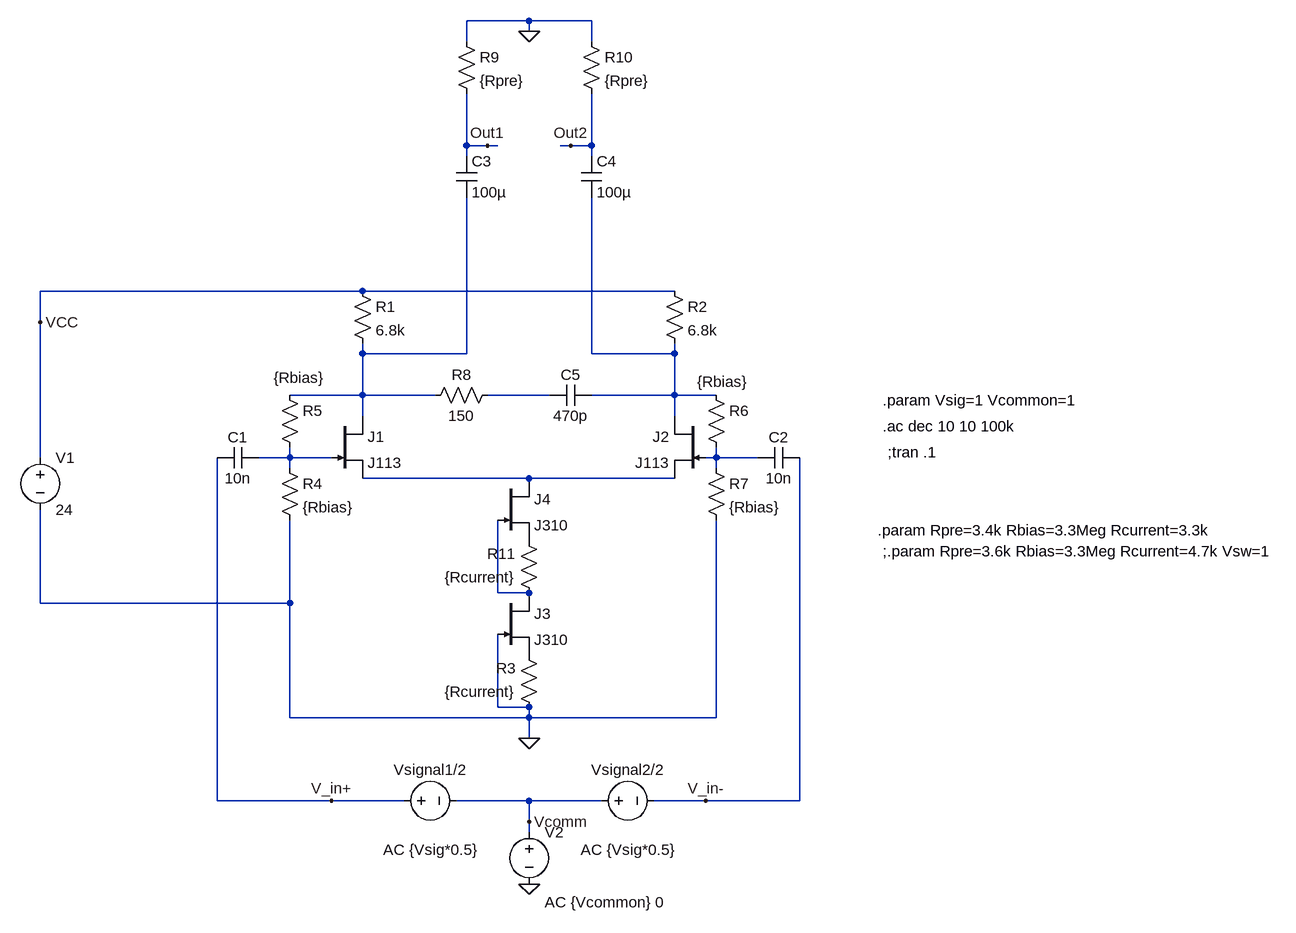
[diagram p0: schematic Preamp_doublecurrent.asc]
Preamp_doublecurrent.asc, the LTspice schematic file:
Version 4
SHEET 1 1784 1228
WIRE 576 -240 480 -240
WIRE 672 -240 576 -240
WIRE 576 -224 576 -240
WIRE 480 -208 480 -240
WIRE 672 -208 672 -240
WIRE 480 -48 480 -128
WIRE 512 -48 480 -48
WIRE 528 -48 512 -48
WIRE 640 -48 624 -48
WIRE 672 -48 672 -128
WIRE 672 -48 640 -48
WIRE 480 -32 480 -48
WIRE 672 -32 672 -48
WIRE 320 176 -176 176
WIRE 800 176 320 176
WIRE -176 224 -176 176
WIRE 320 272 320 256
WIRE 480 272 480 32
WIRE 480 272 320 272
WIRE 672 272 672 32
WIRE 800 272 800 256
WIRE 800 272 672 272
WIRE 320 336 320 272
WIRE 320 336 208 336
WIRE 432 336 320 336
WIRE 608 336 512 336
WIRE 800 336 800 272
WIRE 800 336 672 336
WIRE 864 336 800 336
WIRE 320 368 320 336
WIRE 800 368 800 336
WIRE -176 432 -176 224
WIRE 208 432 208 416
WIRE 208 432 160 432
WIRE 272 432 208 432
WIRE 864 432 864 416
WIRE 864 432 848 432
WIRE 928 432 864 432
WIRE 208 448 208 432
WIRE 864 448 864 432
WIRE 576 464 320 464
WIRE 800 464 576 464
WIRE 528 640 528 528
WIRE 576 640 528 640
WIRE -176 656 -176 512
WIRE 208 656 208 528
WIRE 208 656 -176 656
WIRE 528 816 528 704
WIRE 576 816 528 816
WIRE 208 832 208 656
WIRE 576 832 576 816
WIRE 576 832 208 832
WIRE 864 832 864 528
WIRE 864 832 576 832
WIRE 576 864 576 832
WIRE 96 960 96 432
WIRE 272 960 96 960
WIRE 384 960 272 960
WIRE 576 960 464 960
WIRE 688 960 576 960
WIRE 848 960 768 960
WIRE 992 960 992 432
WIRE 992 960 848 960
WIRE 576 992 576 960
WIRE 576 1008 576 992
FLAG 576 864 0
FLAG -176 224 VCC
FLAG 512 -48 Out1
FLAG 640 -48 Out2
FLAG 576 -224 0
FLAG 848 960 V_in-
FLAG 272 960 V_in+
FLAG 576 1088 0
FLAG 576 992 Vcomm
SYMBOL njf 272 368 R0
SYMATTR InstName J1
SYMATTR Value J113
SYMBOL njf 848 368 M0
SYMATTR InstName J2
SYMATTR Value J113
SYMBOL res 304 160 R0
SYMATTR InstName R1
SYMATTR Value 6.8k
SYMBOL res 784 160 R0
SYMATTR InstName R2
SYMATTR Value 6.8k
SYMBOL res 192 432 R0
SYMATTR InstName R4
SYMATTR Value {Rbias}
SYMBOL res 192 320 R0
WINDOW 3 -9 -11 Left 2
SYMATTR Value {Rbias}
SYMATTR InstName R5
SYMBOL res 848 320 R0
WINDOW 3 -13 -5 Left 2
SYMATTR Value {Rbias}
SYMATTR InstName R6
SYMBOL res 848 432 R0
SYMATTR InstName R7
SYMATTR Value {Rbias}
SYMBOL cap 160 416 R90
WINDOW 0 0 32 VBottom 2
WINDOW 3 32 32 VTop 2
SYMATTR InstName C1
SYMATTR Value 10n
SYMATTR SpiceLine Rser=882.6m Lser=318.58p
SYMBOL cap 992 416 R90
WINDOW 0 0 32 VBottom 2
WINDOW 3 32 32 VTop 2
SYMATTR InstName C2
SYMATTR Value 10n
SYMATTR SpiceLine Rser=786.2m Lser=151.38p
SYMBOL cap 464 -32 R0
SYMATTR InstName C3
SYMATTR Value 100µ
SYMATTR SpiceLine Rser=27.8m Lser=187.57p
SYMBOL cap 656 -32 R0
SYMATTR InstName C4
SYMATTR Value 100µ
SYMATTR SpiceLine Rser=16.5m Lser=200.49p
SYMBOL voltage -176 416 R0
WINDOW 123 0 0 Left 0
SYMATTR InstName V1
SYMATTR Value 24
SYMATTR SpiceLine Rser=0
SYMBOL voltage 368 960 R270
WINDOW 0 32 56 VTop 2
WINDOW 3 -32 56 VBottom 2
WINDOW 123 -60 56 VBottom 2
SYMATTR InstName Vsignal1/2
SYMATTR Value ""
SYMATTR Value2 AC {Vsig*0.5}
SYMATTR SpiceLine Rser=0
SYMBOL njf 528 640 R0
SYMATTR InstName J3
SYMATTR Value J310
SYMBOL res 464 -224 R0
SYMATTR InstName R9
SYMATTR Value {Rpre}
SYMBOL res 656 -224 R0
SYMATTR InstName R10
SYMATTR Value {Rpre}
SYMBOL res 528 320 R90
WINDOW 0 0 56 VBottom 2
WINDOW 3 32 56 VTop 2
SYMATTR InstName R8
SYMATTR Value 150
SYMBOL cap 672 320 R90
WINDOW 0 0 32 VBottom 2
WINDOW 3 32 32 VTop 2
SYMATTR InstName C5
SYMATTR Value 470p
SYMATTR SpiceLine Rser=16.5m Lser=200.49p
SYMBOL voltage 672 960 R270
WINDOW 0 32 56 VTop 2
WINDOW 3 -32 56 VBottom 2
WINDOW 123 -60 56 VBottom 2
SYMATTR InstName Vsignal2/2
SYMATTR Value ""
SYMATTR Value2 AC {Vsig*0.5}
SYMATTR SpiceLine Rser=0
SYMBOL voltage 576 992 R0
WINDOW 3 24 152 Left 2
WINDOW 123 24 124 Left 2
WINDOW 39 0 0 Left 0
SYMATTR Value ""
SYMATTR Value2 AC {Vcommon} 0
SYMATTR InstName V2
SYMBOL res 592 832 R180
WINDOW 0 36 76 Left 2
WINDOW 3 36 40 Left 2
SYMATTR InstName R3
SYMATTR Value {Rcurrent}
SYMBOL njf 528 464 R0
SYMATTR InstName J4
SYMATTR Value J310
SYMBOL res 592 656 R180
WINDOW 0 36 76 Left 2
WINDOW 3 36 40 Left 2
SYMATTR InstName R11
SYMATTR Value {Rcurrent}
TEXT 1120 384 Left 2 !.ac dec 10 10 100k
TEXT 1112 544 Left 2 !.param Rpre=3.4k Rbias=3.3Meg Rcurrent=3.3k
TEXT 1120 344 Left 2 !.param Vsig=1 Vcommon=1
TEXT 1128 424 Left 2 !;tran .1
TEXT 1120 576 Left 2 !;.param Rpre=3.6k Rbias=3.3Meg Rcurrent=4.7k Vsw=1

The netlist it stands for:
* Preamp_doublecurrent.asc
J1 N001 N004 N006 J113
J2 N002 N005 N006 J113
R1 VCC N001 6.8k
R2 VCC N002 6.8k
R4 N004 0 {Rbias}
R5 N001 N004 {Rbias}
R6 N002 N005 {Rbias}
R7 N005 0 {Rbias}
C1 N004 V_in+ 10n Rser=882.6m Lser=318.58p
C2 V_in- N005 10n Rser=786.2m Lser=151.38p
C3 Out1 N001 100µ Rser=27.8m Lser=187.57p
C4 Out2 N002 100µ Rser=16.5m Lser=200.49p
V1 VCC 0 24 Rser=0
Vsignal1/2 V_in+ Vcomm AC {Vsig*0.5} Rser=0
J3 N007 0 P001 J310
R9 0 Out1 {Rpre}
R10 0 Out2 {Rpre}
R8 N003 N001 150
C5 N002 N003 470p Rser=16.5m Lser=200.49p
Vsignal2/2 Vcomm V_in- AC {Vsig*0.5} Rser=0
V2 Vcomm 0 AC {Vcommon} 0
R3 0 P001 {Rcurrent}
J4 N006 N007 P002 J310
R11 N007 P002 {Rcurrent}
.model NJF NJF
.model PJF PJF
.lib standard.jft
.ac dec 10 10 100k
.param Rpre=3.4k Rbias=3.3Meg Rcurrent=3.3k
.param Vsig=1 Vcommon=1
;tran .1
;.param Rpre=3.6k Rbias=3.3Meg Rcurrent=4.7k Vsw=1
.backanno
.end